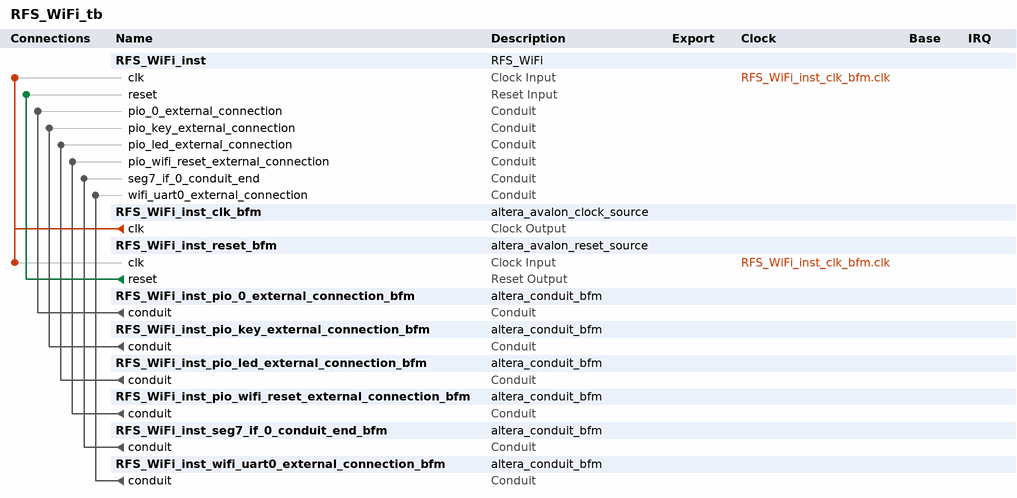
[diagram p0: system contents]
# Platform Designer (Qsys) system RFS_WiFi_tb, Cyclone IV E EP4CE115F29C7
# Parameters at their usual value, and those the tool derives, are not listed.
package require -exact qsys 18.1
create_system RFS_WiFi_tb
set_project_property DEVICE_FAMILY {Cyclone IV E}
set_project_property DEVICE EP4CE115F29C7

add_instance RFS_WiFi_inst RFS_WiFi 1.0

add_instance RFS_WiFi_inst_clk_bfm altera_avalon_clock_source 18.1

add_instance RFS_WiFi_inst_reset_bfm altera_avalon_reset_source 18.1
set_instance_parameter_value RFS_WiFi_inst_reset_bfm ASSERT_HIGH_RESET 0
set_instance_parameter_value RFS_WiFi_inst_reset_bfm INITIAL_RESET_CYCLES 50

add_instance RFS_WiFi_inst_pio_0_external_connection_bfm altera_conduit_bfm 18.1
set_instance_parameter_value RFS_WiFi_inst_pio_0_external_connection_bfm CLOCKED_SIGNAL false
set_instance_parameter_value RFS_WiFi_inst_pio_0_external_connection_bfm ENABLE_RESET false
set_instance_parameter_value RFS_WiFi_inst_pio_0_external_connection_bfm SIGNAL_DIRECTIONS output
set_instance_parameter_value RFS_WiFi_inst_pio_0_external_connection_bfm SIGNAL_WIDTHS 8

add_instance RFS_WiFi_inst_pio_key_external_connection_bfm altera_conduit_bfm 18.1
set_instance_parameter_value RFS_WiFi_inst_pio_key_external_connection_bfm CLOCKED_SIGNAL false
set_instance_parameter_value RFS_WiFi_inst_pio_key_external_connection_bfm ENABLE_RESET false
set_instance_parameter_value RFS_WiFi_inst_pio_key_external_connection_bfm SIGNAL_DIRECTIONS output
set_instance_parameter_value RFS_WiFi_inst_pio_key_external_connection_bfm SIGNAL_WIDTHS 2

add_instance RFS_WiFi_inst_pio_led_external_connection_bfm altera_conduit_bfm 18.1
set_instance_parameter_value RFS_WiFi_inst_pio_led_external_connection_bfm CLOCKED_SIGNAL false
set_instance_parameter_value RFS_WiFi_inst_pio_led_external_connection_bfm ENABLE_RESET false
set_instance_parameter_value RFS_WiFi_inst_pio_led_external_connection_bfm SIGNAL_DIRECTIONS input
set_instance_parameter_value RFS_WiFi_inst_pio_led_external_connection_bfm SIGNAL_WIDTHS 4

add_instance RFS_WiFi_inst_pio_wifi_reset_external_connection_bfm altera_conduit_bfm 18.1
set_instance_parameter_value RFS_WiFi_inst_pio_wifi_reset_external_connection_bfm CLOCKED_SIGNAL false
set_instance_parameter_value RFS_WiFi_inst_pio_wifi_reset_external_connection_bfm ENABLE_RESET false
set_instance_parameter_value RFS_WiFi_inst_pio_wifi_reset_external_connection_bfm SIGNAL_DIRECTIONS input
set_instance_parameter_value RFS_WiFi_inst_pio_wifi_reset_external_connection_bfm SIGNAL_WIDTHS 1

add_instance RFS_WiFi_inst_seg7_if_0_conduit_end_bfm altera_conduit_bfm 18.1
set_instance_parameter_value RFS_WiFi_inst_seg7_if_0_conduit_end_bfm CLOCKED_SIGNAL false
set_instance_parameter_value RFS_WiFi_inst_seg7_if_0_conduit_end_bfm ENABLE_RESET false
set_instance_parameter_value RFS_WiFi_inst_seg7_if_0_conduit_end_bfm SIGNAL_DIRECTIONS input
set_instance_parameter_value RFS_WiFi_inst_seg7_if_0_conduit_end_bfm SIGNAL_WIDTHS 48

add_instance RFS_WiFi_inst_wifi_uart0_external_connection_bfm altera_conduit_bfm 18.1
set_instance_parameter_value RFS_WiFi_inst_wifi_uart0_external_connection_bfm CLOCKED_SIGNAL false
set_instance_parameter_value RFS_WiFi_inst_wifi_uart0_external_connection_bfm ENABLE_RESET false
set_instance_parameter_value RFS_WiFi_inst_wifi_uart0_external_connection_bfm SIGNAL_DIRECTIONS output,input,output,input
set_instance_parameter_value RFS_WiFi_inst_wifi_uart0_external_connection_bfm SIGNAL_ROLES cts_n,rts_n,rxd,txd
set_instance_parameter_value RFS_WiFi_inst_wifi_uart0_external_connection_bfm SIGNAL_WIDTHS 1,1,1,1

# connections
add_connection RFS_WiFi_inst_clk_bfm.clk RFS_WiFi_inst.clk clock
add_connection RFS_WiFi_inst_clk_bfm.clk RFS_WiFi_inst_reset_bfm.clk clock
add_connection RFS_WiFi_inst_reset_bfm.reset RFS_WiFi_inst.reset reset
add_connection RFS_WiFi_inst_pio_0_external_connection_bfm.conduit RFS_WiFi_inst.pio_0_external_connection conduit
add_connection RFS_WiFi_inst_pio_key_external_connection_bfm.conduit RFS_WiFi_inst.pio_key_external_connection conduit
add_connection RFS_WiFi_inst_pio_led_external_connection_bfm.conduit RFS_WiFi_inst.pio_led_external_connection conduit
add_connection RFS_WiFi_inst_pio_wifi_reset_external_connection_bfm.conduit RFS_WiFi_inst.pio_wifi_reset_external_connection conduit
add_connection RFS_WiFi_inst_seg7_if_0_conduit_end_bfm.conduit RFS_WiFi_inst.seg7_if_0_conduit_end conduit
add_connection RFS_WiFi_inst_wifi_uart0_external_connection_bfm.conduit RFS_WiFi_inst.wifi_uart0_external_connection conduit

set_interconnect_requirement {$system} qsys_mm.clockCrossingAdapter HANDSHAKE
set_interconnect_requirement {$system} qsys_mm.enableEccProtection FALSE
set_interconnect_requirement {$system} qsys_mm.insertDefaultSlave FALSE
set_interconnect_requirement {$system} qsys_mm.maxAdditionalLatency 1

save_system RFS_WiFi_tb.qsys
